# Altium schematic sheet Esquematico_DIY_2.SchDoc
size A4
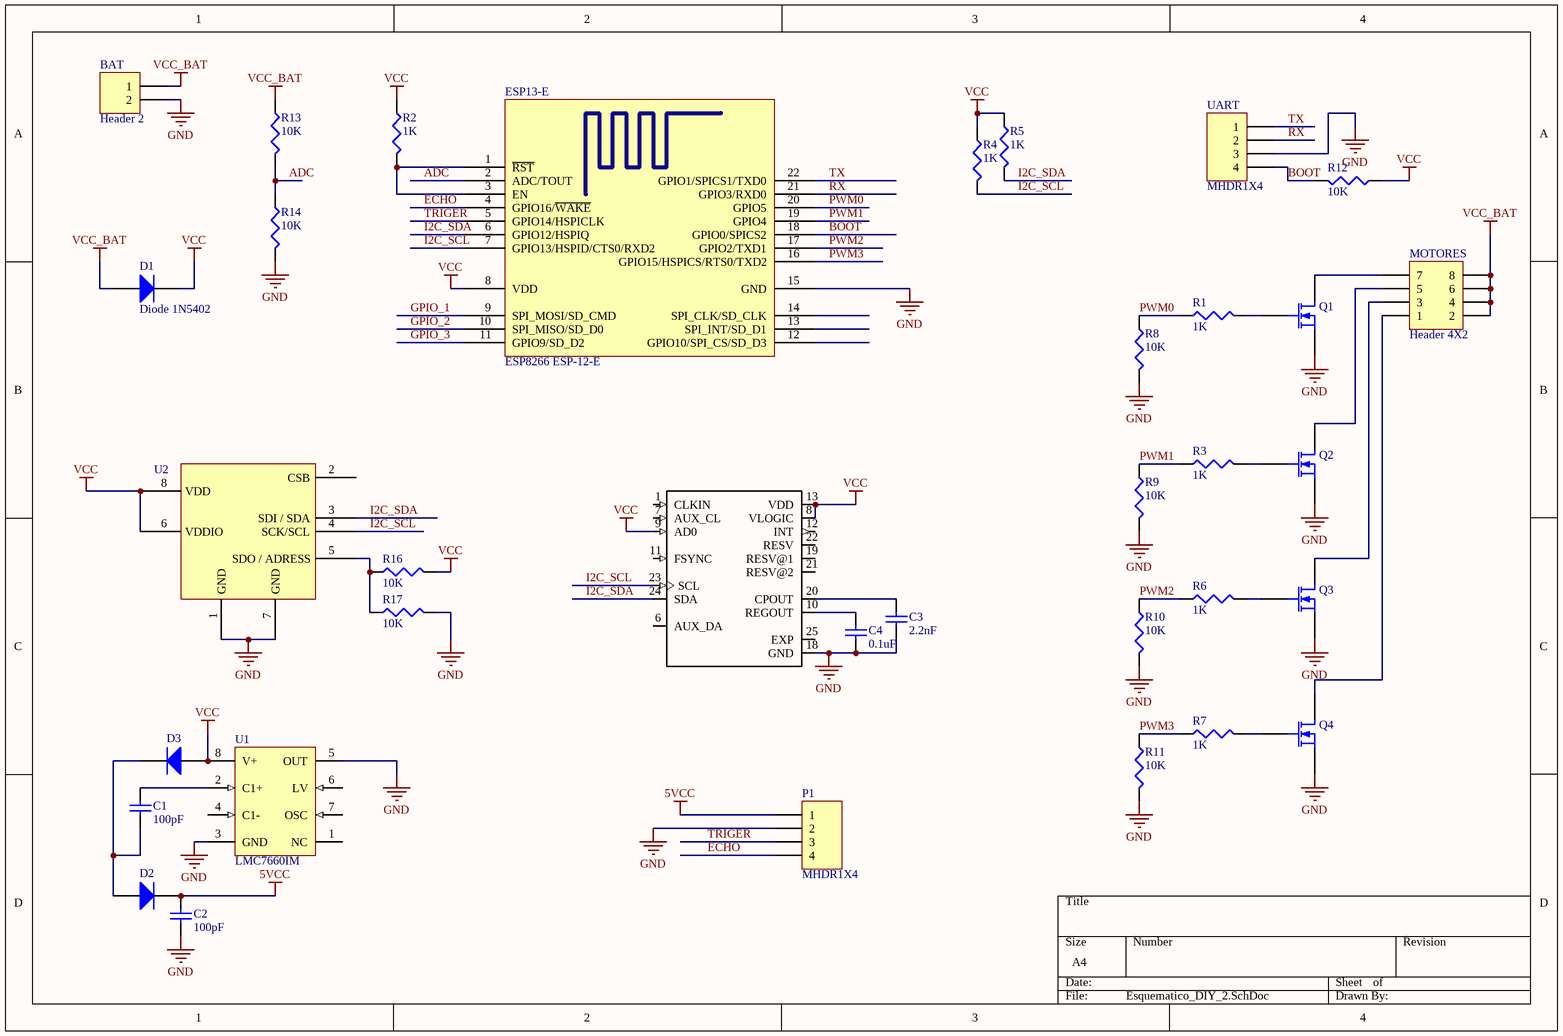
[diagram p0: Esquematico_DIY_2.SchDoc]

## Parts
BAT  Header 2  [MHDR1X2]
C1  value 100pF  [C0805]  (hidden comment: Cap)
C2  value 100pF  [C0805]  (hidden comment: Cap)
C3  value 2.2nF  [C0805]  (hidden comment: Cap)
C4  value 0.1uF  [C0805]  (hidden comment: Cap)
D1  Diode 1N5402  [DSO-C2/X2.3]
D2  Diode 1N5402  [DSO-C2/Z6.7]  (value not drawn)
D3  Diode 1N5402  [DSO-C2/Z6.7]  (value not drawn)
ESP13-E  ESP8266 ESP-12-E  [ESP8266 ESP-12-E B]
MOTORES  Header 4X2  [HDR2X4]
P1  MHDR1X4  [MHDR1X4]
Q1  MOSFET-N  [SOT23-3]  (value not drawn)
Q2  MOSFET-N  [SOT23-3]  (value not drawn)
Q3  MOSFET-N  [SOT23-3]  (value not drawn)
Q4  MOSFET-N  [SOT23-3]  (value not drawn)
R1  value 1K  [C0805]  (hidden comment: Res3)
R2  value 1K  [C0805]  (hidden comment: Res3)
R3  value 1K  [C0805]  (hidden comment: Res3)
R4  value 1K  [C1206]  (hidden comment: Res3)
R5  value 1K  [C1206]  (hidden comment: Res3)
R6  value 1K  [C0805]  (hidden comment: Res3)
R7  value 1K  [C0805]  (hidden comment: Res3)
R8  value 10K  [C0805]  (hidden comment: Res3)
R9  value 10K  [C0805]  (hidden comment: Res3)
R10  value 10K  [C0805]  (hidden comment: Res3)
R11  value 10K  [C0805]  (hidden comment: Res3)
R12  value 10K  [C0805]  (hidden comment: Res3)
R13  value 10K  [C0805]  (hidden comment: Res3)
R14  value 10K  [C0805]  (hidden comment: Res3)
R16  value 10K  [C0805]  (hidden comment: Res3)
R17  value 10K  [C1206]  (hidden comment: Res3)
U1  LMC7660IM  [M08A_N]
U2  BMP280  [LGA-8_BMP280(Primary)]  (value not drawn)
U3  MPU-6050  [QFN50P400X400X95-25N]  (value not drawn)
UART  MHDR1X4  [MHDR1X4]

## Nets
5VCC: C2.2 D2.2(K) P1.1
GND: BAT.2 C2.1 C3.2 C4.2 ESP13-E.15(GND) P1.2 Q1.3(S) Q2.3(S) Q3.3(S) Q4.3(S) R8.2 R9.2 R10.2 R11.2 R14.2 R17.2 U1.3(GND) U1.5(OUT) U2.1(GND) U2.7(GND) U3.18(GND) UART.3
VCC: D1.2(K) D3.1(A) ESP13-E.8(VDD) R2.1 R4.2 R5.2 R12.1 R16.2 U1.8(V+) U2.6(VDDIO) U2.8(VDD) U3.8(VLOGIC) U3.9(AD0) U3.13(VDD)
VCC_BAT: BAT.1 D1.1(A) MOTORES.2 MOTORES.4 MOTORES.6 MOTORES.8 R13.1
ADC: ESP13-E.2(ADC/TOUT) R13.2 R14.1
BOOT: ESP13-E.18(GPIO0/SPICS2) R12.2 UART.4
ECHO: ESP13-E.4(GPIO16/~{WAKE}) P1.4
GPIO_1: ESP13-E.9(SPI_MOSI/SD_CMD)
GPIO_2: ESP13-E.10(SPI_MISO/SD_D0)
GPIO_3: ESP13-E.11(GPIO9/SD_D2)
I2C_SCL: ESP13-E.7(GPIO13/HSPID/CTS0/RXD2) R4.1 U2.4(SCK/SCL) U3.23(SCL)
I2C_SDA: ESP13-E.6(GPIO12/HSPIQ) R5.1 U2.3(SDI_/_SDA) U3.24(SDA)
PWM0: ESP13-E.20(GPIO5) R1.1 R8.1
PWM1: ESP13-E.19(GPIO4) R3.1 R9.1
PWM2: ESP13-E.17(GPIO2/TXD1) R6.1 R10.1
PWM3: ESP13-E.16(GPIO15/HSPICS/RTS0/TXD2) R7.1 R11.1
RX: ESP13-E.21(GPIO3/RXD0) UART.2
TRIGER: ESP13-E.5(GPIO14/HSPICLK) P1.3
TX: ESP13-E.22(GPIO1/SPICS1/TXD0) UART.1
NetC1_1: C1.1 U1.2(C1+)
NetC1_2: C1.2 D2.1(A) D3.2(K)
NetC3_1: C3.1 U3.20(CPOUT)
NetC4_1: C4.1 U3.10(REGOUT)
NetESP13-E_1: ESP13-E.1(~{RST}) ESP13-E.3(EN) R2.2
NetMOTORES_1: MOTORES.1 Q4.1(D)
NetMOTORES_3: MOTORES.3 Q3.1(D)
NetMOTORES_5: MOTORES.5 Q2.1(D)
NetMOTORES_7: MOTORES.7 Q1.1(D)
NetQ1_2: Q1.2(G) R1.2
NetQ2_2: Q2.2(G) R3.2
NetQ3_2: Q3.2(G) R6.2
NetQ4_2: Q4.2(G) R7.2
NetR16_1: R16.1 R17.1 U2.5(SDO_/_ADRESS)

Not connected (* = marked no-connect by the designer): ESP13-E 12(GPIO10/SPI_CS/SD_D3) 13(SPI_INT/SD_D1) 14(SPI_CLK/SD_CLK); U1 1(NC) 4(C1-) 6(LV) 7(OSC); U2 2(CSB); U3 1(CLKIN) 6(AUX_DA) 7(AUX_CL) 11(FSYNC) 12(INT) 19(RESV@1) 21(RESV@2) 22(RESV) 25(EXP)

## Library data of the parts
BAT = Header 2: Header, 2-Pin; LatestRevisionDate: 17-Jul-2002; LatestRevisionNote: Re-released for DXP Platform.; Publisher: Altium Limited
C1-C4 = Cap: Capacitor; Published: 8-Jun-2000; LatestRevisionDate: 17-Jul-2002; LatestRevisionNote: Re-released for DXP Platform.; PackageReference: RAD-0.3; Publisher: Altium Limited; PackageDescription: Radial Cap, Thru-Hole; 2 Leads; 0.3 in Pin Spacing
D1-D3 = Diode 1N5402: 3 Amp General Purpose Rectifier; Published: 8-Jun-2000; LatestRevisionDate: 17-Jul-2002; LatestRevisionNote: Re-released for DXP Platform.; DatasheetVersion: 1998; PackageVersion: Aug-1999; PackageReference: DO-201AD; Publisher: Altium Limited; PackageDescription: Diode, Axial; Body 9.5 x 5.6 mm (LxDia. max), Lead Dia. 1.32 mm (max); ComponentLink1Description: Manufacturer Link; ComponentLink1URL: http://www.fairchildsemi.com/; ComponentLink2Description: Datasheet; ComponentLink2URL: http://www.fairchildsemi.com/ds/1N%2F1N5400.pdf
MOTORES = Header 4X2: Header, 4-Pin, Dual row; LatestRevisionDate: 17-Jul-2002; LatestRevisionNote: Re-released for DXP Platform.; Publisher: Altium Limited
P1 UART = MHDR1X4: Header, 4-Pin; LatestRevisionDate: 17-Jul-2002; LatestRevisionNote: Re-released for DXP Platform.; Publisher: Altium Limited
Q1-Q4 = MOSFET-N: N-Channel MOSFET; pin to pad: 1>3 2>1 3>2; Published: 8-Jun-2000; LatestRevisionDate: 17-Jul-2002; LatestRevisionNote: Re-released for DXP Platform.; PackageVersion: 1995/1996; PackageReference: E3; Publisher: Altium Limited; PackageDescription: TO, Flat Index; 3 In-Line, Axial Leads; Body Dia. 4.6mm; Lead Dia. 0.5 mm (max)
R1-R14 R16 R17 = Res3: Resistor; Published: 8-Jun-2000; LatestRevisionDate: 29-May-2009; LatestRevisionNote: IPC-7351 Footprint Added.; PackageReference: J1-0603; Publisher: Altium Limited; PackageDescription: Chip Resistor
U1 = LMC7660IM: Switched Capacitor Voltage Converter, 8-pin Narrow SOIC; Manufacturer: National Semiconductor; PackageTopMarking: NSZXTT*LMC76*60IM; PowerWise: N; CompType: Switch Caps; Published: 4-Dec-2008; DatasheetVersion: Feb-2005; PackageVersion: revM, May-2009; PackageReference: M08A; Publisher: Altium Limited; PackageDescription: SOIC Narrow, 4.9 x 3.9 x 1.45mm, 8 Lead, 1.27mm Pitch; PartNumber: LMC7660IM; RoHS: N; PinCount: 8; Code_JEDEC: MS-012-AA; Code_IPC: SOIC127P600-8; ComponentLink1Description: LMC7660 Datasheet; ComponentLink1URL: http://www.national.com/ds/LM/LMC7660.pdf; ComponentLink2Description: LMC7660 Web Page; ComponentLink2URL: http://www.national.com/pf/LM/LMC7660.html; ComponentLink3Description: M08A Package Page; ComponentLink3URL: http://www.national.com/packaging/folders/m08a.html
U2 = BMP280: Barometro; Value: *
U3 = MPU-6050: Value: *